# EAGLE design BOTS_test (EAGLE 9.2.2)
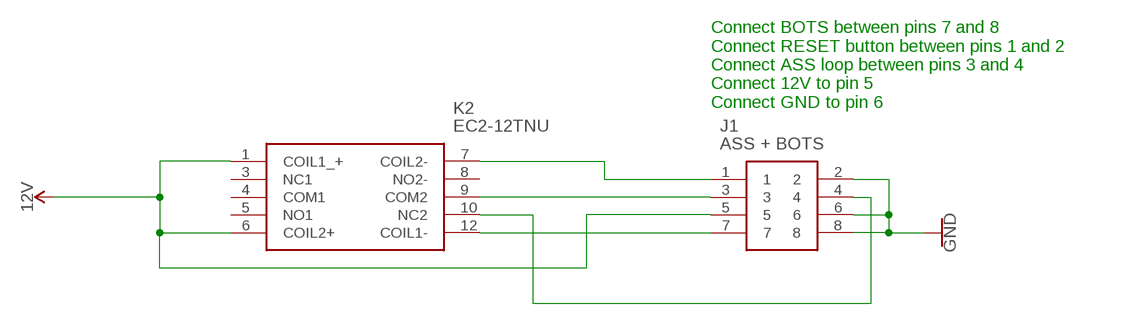
[diagram p0: schematic, sheet 1]

## Parts
J1  ASS + BOTS  T821108A1S100CEU  [HDRV8W64P254_2X4_1778X895X915P]
K2  EC2-12TNU  [EC212TNU]

## Nets
12V: J1.5 K2.1(COIL1_+) K2.6(COIL2+)
ASS1: J1.4 K2.10(NC2)
GND: J1.2 J1.6 J1.8
N$1: J1.1 K2.7(COIL2-)
N$2: J1.7 K2.12(COIL1-)
N$3: J1.3 K2.9(COM2)
Unconnected: K2.3(NC1) K2.4(COM1) K2.5(NO1) K2.8(NO2-)

## Notes on the sheet
- Connect BOTS between pins 7 and 8
  Connect RESET button between pins 1 and 2
  Connect ASS loop between pins 3 and 4
  Connect 12V to pin 5
  Connect GND to pin 6

## Library data of the parts
J1 = T821108A1S100CEU:T821108A1S100CEU: HEADER, VERTICAL, 2.54MM, 8WAY Amphenol T821 Series, 2.54mm Pitch 8 Way 2 Row Straight PCB Header, Solder Termination, 3A Source: Datasheet <http://uk.rs-online.com/web/p/products/1702738>; DESCRIPTION: HEADER, VERTICAL, 2.54MM, 8WAY Amphenol T821 Series, 2.54mm Pitch 8 Way 2 Row Straight PCB Header, Solder Termination, 3A; HEIGHT: 9.15mm; MANUFACTURER_NAME: Amphenol; MANUFACTURER_PART_NUMBER: T821108A1S100CEU; RS_PART_NUMBER: 1702738
K2 = SamacSys_Parts:EC2-12TNU: DPDT Through Hole Latching Relay, 2 A, 12V dc Source: Datasheet <https://componentsearchengine.com/Datasheets/1/EC2-12TNU.pdf>; DESCRIPTION: DPDT Through Hole Latching Relay, 2 A, 12V dc; HEIGHT: 9mm; MANUFACTURER_NAME: Kemet; MANUFACTURER_PART_NUMBER: EC2-12TNU; MOUSER_PART_NUMBER: 80-EC2-12TNU

## Board
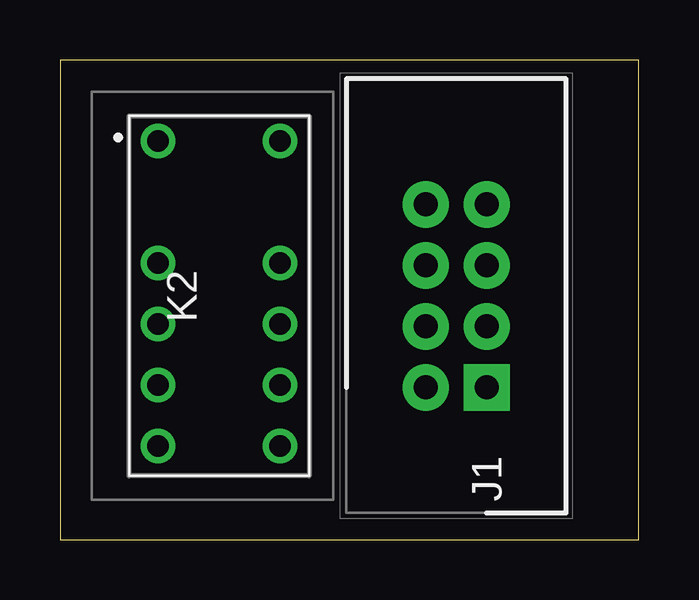
[diagram p1: board, top side]
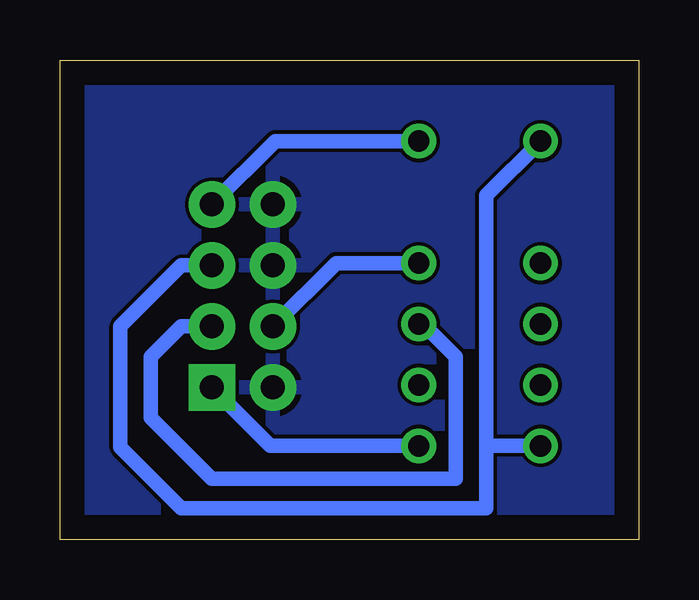
[diagram p2: board, bottom side, seen from below]

Size 24.11 x 19.99 mm. Coordinates in mm from the lower left corner, seen from the top.
Outline: 0,0 24.11,0 24.11,19.99 0,19.99 0,0
Copper layers (1*16): Top 0.035mm / dielectric 1.5mm / Bottom 0.035mm
Design rules "default": minimum track width 6mil, minimum drill 0.35mm, track to track 6mil, track to pad 6mil, pad to pad 6mil, via to via 6mil, smd to smd 6mil, copper to edge 40mil, drill to drill 6mil, minimum pad ring 10mil, minimum via ring 8mil, stop-mask expansion 4mil, vias tented up to drill 0mil, thermal gap 10mil

### Footprints (pad centres in the part's own frame; a part is rotated, then mirrored left to right if it is on the bottom)
HDRV8W64P254_2X4_1778X895X915P = drill 1 pad 1.93 square: 1 0,0 | drill 1 pad 1.93: 2 0,2.54; 3 2.54,0; 4 2.54,2.54; 5 5.08,0; 6 5.08,2.54; 7 7.62,0; 8 7.62,2.54
EC212TNU = drill 0.89 pad 1.446: 1 -6.45,-2.265; 3 -1.37,-2.265; 4 1.17,-2.265; 5 3.71,-2.265; 6 6.25,-2.265; 7 6.25,2.815; 8 3.71,2.815; 9 1.17,2.815; 10 -1.37,2.815; 12 -6.45,2.815

### Placement (x,y rotation side)
J1  17.78,6.35 90 top
K2  6.35,10.16 270 top

### Tracks (layer width: path | path; a pad name or v marks a point on that pad's centre or on a via)
12V
  Bottom 0.61: J1.5 19.05,11.43 21.59,8.89 21.59,3.86 19.05,1.32 6.35,1.32 6.35,3.81 | K2.6 6.25,3.91 6.35,3.81 | 6.35,3.81 6.35,14.35 K2.1
ASS1
  Bottom 0.61: K2.10 12.6,11.53 J1.4
GND
  pour Bottom: 0,0 24.13,0 24.13,20.32 0,20.32
N$1
  Bottom 0.61: K2.7 15.34,3.91 J1.1
N$2
  Bottom 0.61: K2.12 15.14,16.61 J1.7
N$3
  Bottom 0.61: K2.9 8.99,8.99 7.62,7.62 7.62,2.54 17.78,2.54 20.32,5.08 20.32,7.62 19.05,8.89 J1.3